# Altium schematic sheet COBConnector.SchDoc
size C; SheetNumber: 2; SheetTotal: 2
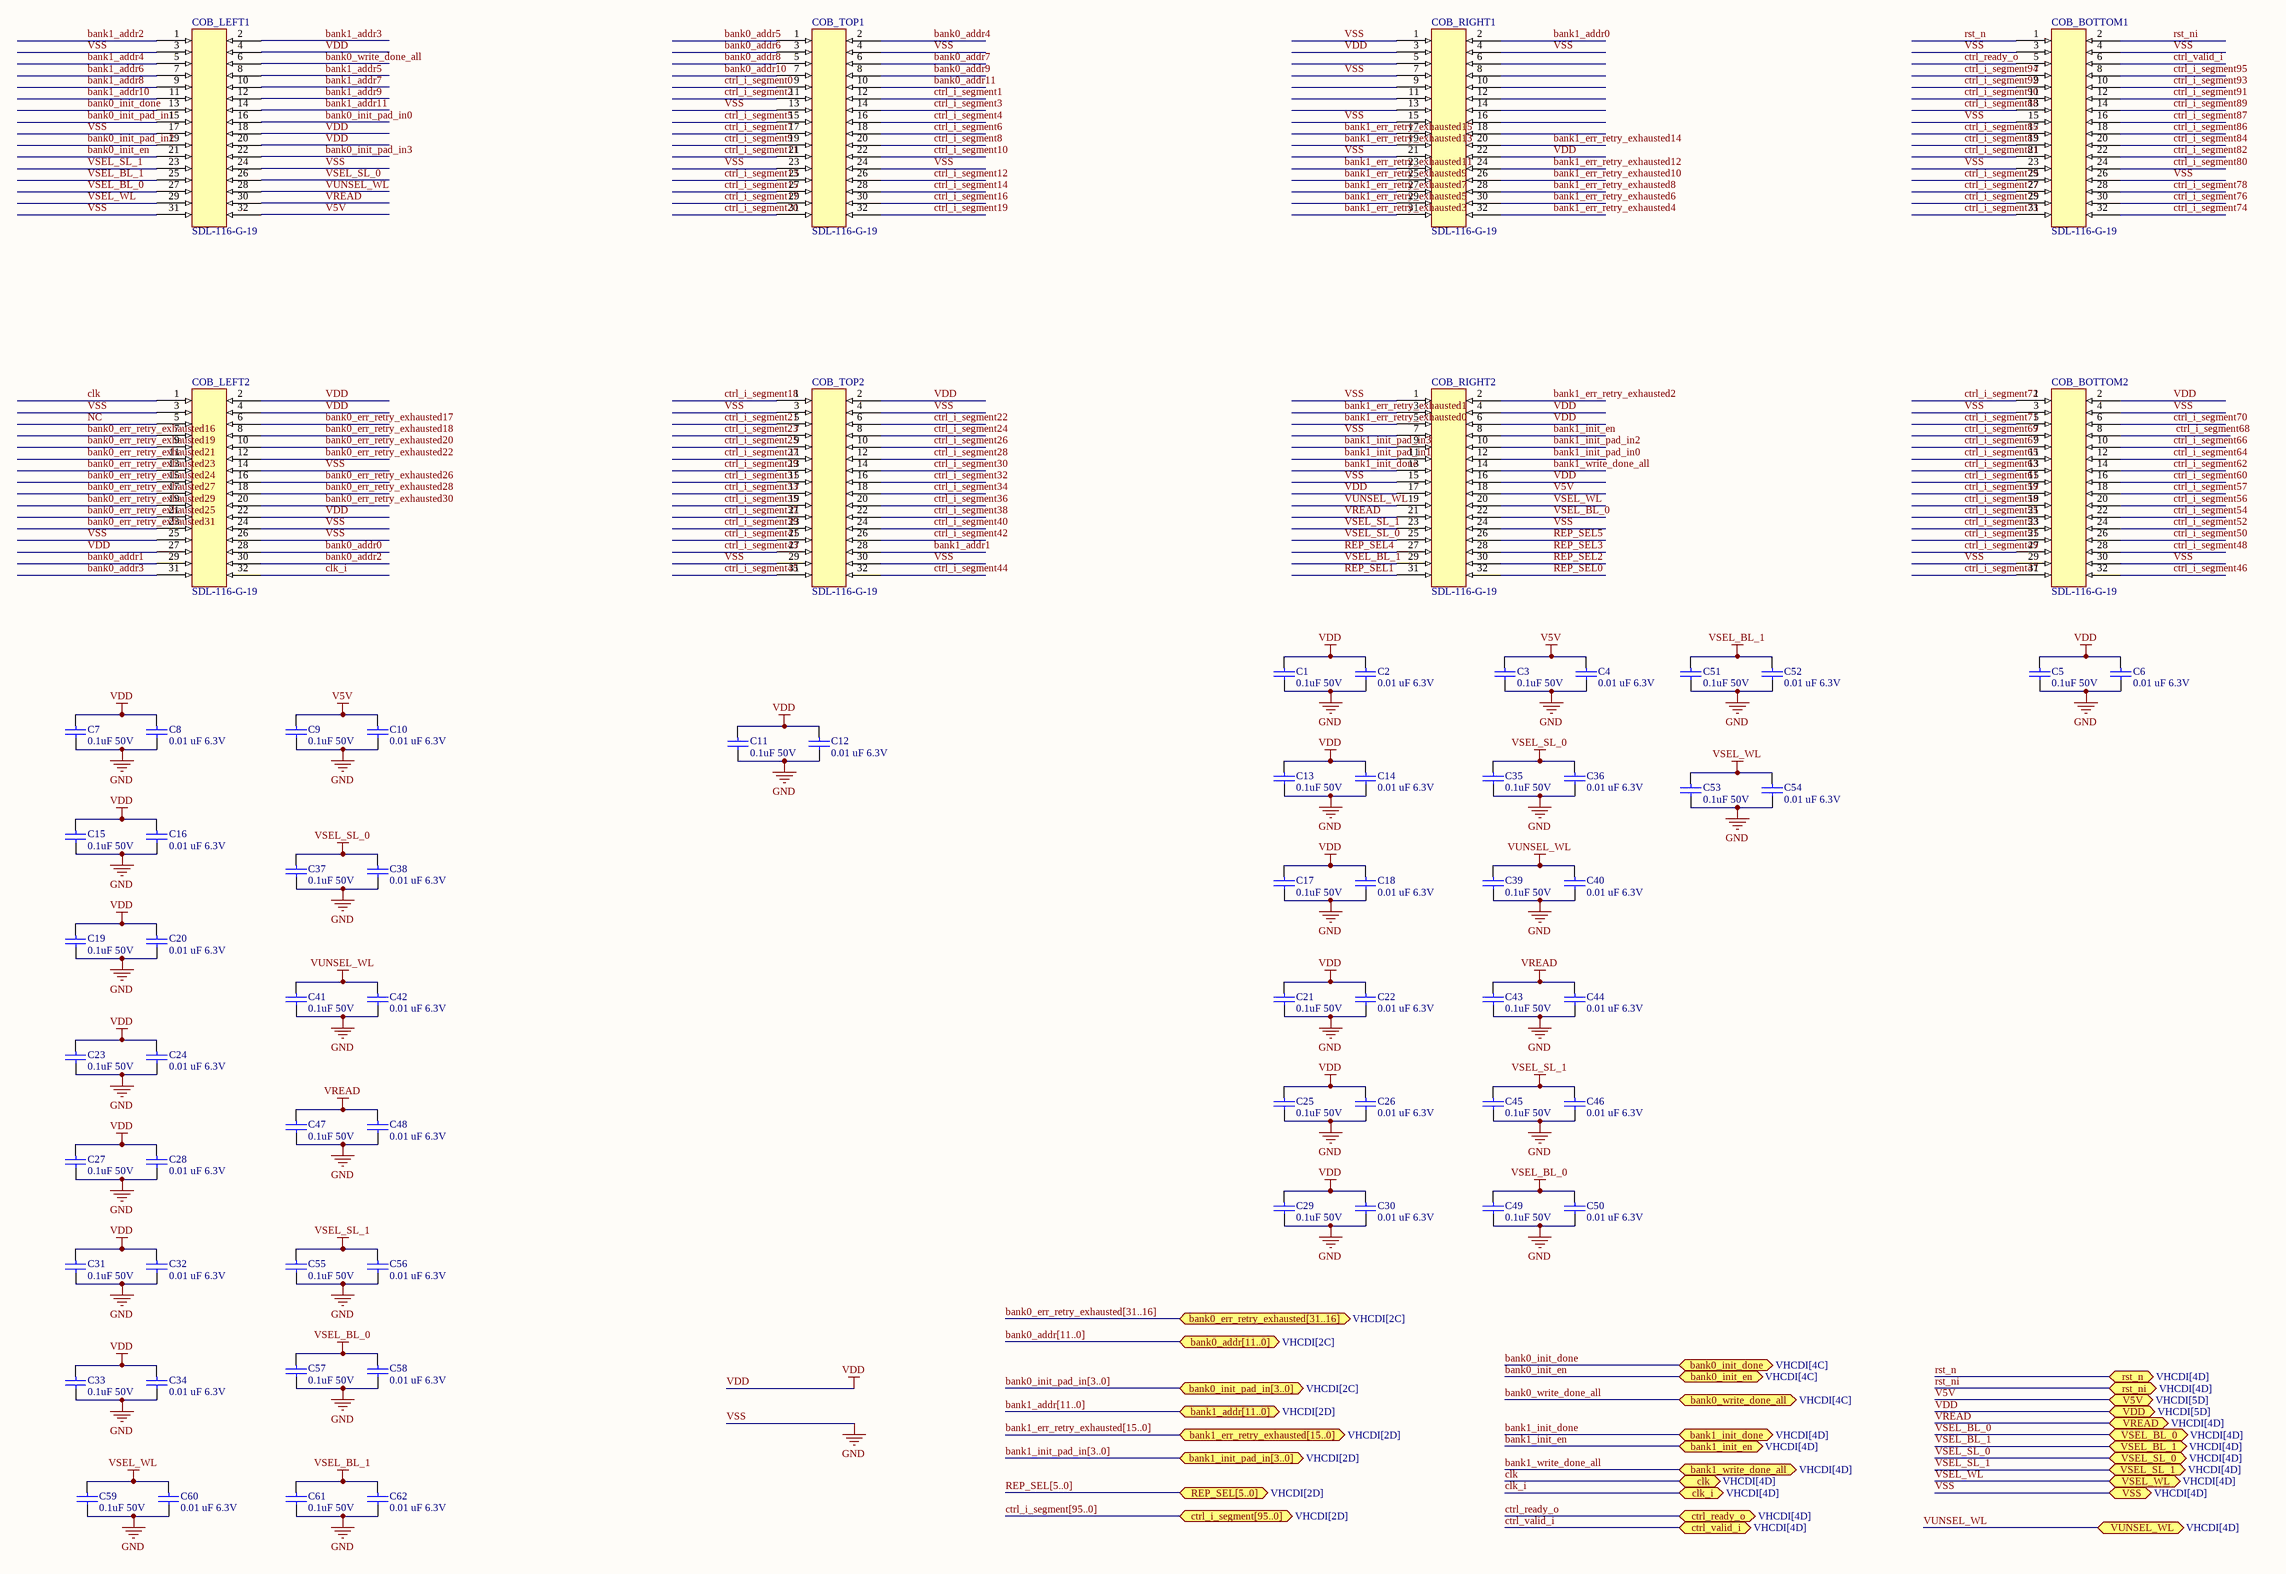
[diagram p0: COBConnector.SchDoc]

## Parts
C1  0.1uF 50V  [C0603-XXXXXX-XXX]
C2  0.01 uF 6.3V  [C0603-XXXXXX-XXX]
C3  0.1uF 50V  [C0603-XXXXXX-XXX]
C4  0.01 uF 6.3V  [C0603-XXXXXX-XXX]
C5  0.1uF 50V  [C0603-XXXXXX-XXX]
C6  0.01 uF 6.3V  [C0603-XXXXXX-XXX]
C7  0.1uF 50V  [C0603-XXXXXX-XXX]
C8  0.01 uF 6.3V  [C0603-XXXXXX-XXX]
C9  0.1uF 50V  [C0603-XXXXXX-XXX]
C10  0.01 uF 6.3V  [C0603-XXXXXX-XXX]
C11  0.1uF 50V  [C0603-XXXXXX-XXX]
C12  0.01 uF 6.3V  [C0603-XXXXXX-XXX]
C13  0.1uF 50V  [C0603-XXXXXX-XXX]
C14  0.01 uF 6.3V  [C0603-XXXXXX-XXX]
C15  0.1uF 50V  [C0603-XXXXXX-XXX]
C16  0.01 uF 6.3V  [C0603-XXXXXX-XXX]
C17  0.1uF 50V  [C0603-XXXXXX-XXX]
C18  0.01 uF 6.3V  [C0603-XXXXXX-XXX]
C19  0.1uF 50V  [C0603-XXXXXX-XXX]
C20  0.01 uF 6.3V  [C0603-XXXXXX-XXX]
C21  0.1uF 50V  [C0603-XXXXXX-XXX]
C22  0.01 uF 6.3V  [C0603-XXXXXX-XXX]
C23  0.1uF 50V  [C0603-XXXXXX-XXX]
C24  0.01 uF 6.3V  [C0603-XXXXXX-XXX]
C25  0.1uF 50V  [C0603-XXXXXX-XXX]
C26  0.01 uF 6.3V  [C0603-XXXXXX-XXX]
C27  0.1uF 50V  [C0603-XXXXXX-XXX]
C28  0.01 uF 6.3V  [C0603-XXXXXX-XXX]
C29  0.1uF 50V  [C0603-XXXXXX-XXX]
C30  0.01 uF 6.3V  [C0603-XXXXXX-XXX]
C31  0.1uF 50V  [C0603-XXXXXX-XXX]
C32  0.01 uF 6.3V  [C0603-XXXXXX-XXX]
C33  0.1uF 50V  [C0603-XXXXXX-XXX]
C34  0.01 uF 6.3V  [C0603-XXXXXX-XXX]
C35  0.1uF 50V  [C0603-XXXXXX-XXX]
C36  0.01 uF 6.3V  [C0603-XXXXXX-XXX]
C37  0.1uF 50V  [C0603-XXXXXX-XXX]
C38  0.01 uF 6.3V  [C0603-XXXXXX-XXX]
C39  0.1uF 50V  [C0603-XXXXXX-XXX]
C40  0.01 uF 6.3V  [C0603-XXXXXX-XXX]
C41  0.1uF 50V  [C0603-XXXXXX-XXX]
C42  0.01 uF 6.3V  [C0603-XXXXXX-XXX]
C43  0.1uF 50V  [C0603-XXXXXX-XXX]
C44  0.01 uF 6.3V  [C0603-XXXXXX-XXX]
C45  0.1uF 50V  [C0603-XXXXXX-XXX]
C46  0.01 uF 6.3V  [C0603-XXXXXX-XXX]
C47  0.1uF 50V  [C0603-XXXXXX-XXX]
C48  0.01 uF 6.3V  [C0603-XXXXXX-XXX]
C49  0.1uF 50V  [C0603-XXXXXX-XXX]
C50  0.01 uF 6.3V  [C0603-XXXXXX-XXX]
C51  0.1uF 50V  [C0603-XXXXXX-XXX]
C52  0.01 uF 6.3V  [C0603-XXXXXX-XXX]
C53  0.1uF 50V  [C0603-XXXXXX-XXX]
C54  0.01 uF 6.3V  [C0603-XXXXXX-XXX]
C55  0.1uF 50V  [C0603-XXXXXX-XXX]
C56  0.01 uF 6.3V  [C0603-XXXXXX-XXX]
C57  0.1uF 50V  [C0603-XXXXXX-XXX]
C58  0.01 uF 6.3V  [C0603-XXXXXX-XXX]
C59  0.1uF 50V  [C0603-XXXXXX-XXX]
C60  0.01 uF 6.3V  [C0603-XXXXXX-XXX]
C61  0.1uF 50V  [C0603-XXXXXX-XXX]
C62  0.01 uF 6.3V  [C0603-XXXXXX-XXX]
COB_BOTTOM1  SDL-116-G-19  [CON32_2X16_TU_DSL_SAI]
COB_BOTTOM2  SDL-116-G-19  [CON32_2X16_TU_DSL_SAI]
COB_LEFT1  SDL-116-G-19  [CON32_2X16_TU_DSL_SAI]
COB_LEFT2  SDL-116-G-19  [CON32_2X16_TU_DSL_SAI]
COB_RIGHT1  SDL-116-G-19  [CON32_2X16_TU_DSL_SAI]
COB_RIGHT2  SDL-116-G-19  [CON32_2X16_TU_DSL_SAI]
COB_TOP1  SDL-116-G-19  [CON32_2X16_TU_DSL_SAI]
COB_TOP2  SDL-116-G-19  [CON32_2X16_TU_DSL_SAI]

## Ports
bank0_addr[11..0] (bidir, see VHCDI[2C]), bank0_err_retry_exhausted[31..16] (bidir, see VHCDI[2C]), bank0_init_done (bidir, see VHCDI[4C]), bank0_init_en (bidir, see VHCDI[4C]), bank0_init_pad_in[3..0] (bidir, see VHCDI[2C]), bank0_write_done_all (bidir, see VHCDI[4C]), bank1_addr[11..0] (bidir, see VHCDI[2D]), bank1_err_retry_exhausted[15..0] (bidir, see VHCDI[2D]), bank1_init_done (bidir, see VHCDI[4D]), bank1_init_en (bidir, see VHCDI[4D]), bank1_init_pad_in[3..0] (bidir, see VHCDI[2D]), bank1_write_done_all (bidir, see VHCDI[4D]), clk (bidir, see VHCDI[4D]), clk_i (bidir, see VHCDI[4D]), ctrl_i_segment[95..0] (bidir, see VHCDI[2D]), ctrl_ready_o (bidir, see VHCDI[4D]), ctrl_valid_i (bidir, see VHCDI[4D]), REP_SEL[5..0] (bidir, see VHCDI[2D]), rst_n (bidir, see VHCDI[4D]), rst_ni (bidir, see VHCDI[4D]), V5V (bidir, see VHCDI[5D]), VDD (bidir, see VHCDI[5D]), VREAD (bidir, see VHCDI[4D]), VSEL_BL_0 (bidir, see VHCDI[4D]), VSEL_BL_1 (bidir, see VHCDI[4D]), VSEL_SL_0 (bidir, see VHCDI[4D]), VSEL_SL_1 (bidir, see VHCDI[4D]), VSEL_WL (bidir, see VHCDI[4D]), VSS (bidir, see VHCDI[4D]), VUNSEL_WL (bidir, see VHCDI[4D])

## Nets
V5V: C3.1 C4.1 C9.1 C10.1 COB_LEFT1.32 COB_RIGHT2.18 ; port V5V
VDD: C1.1 C2.1 C5.1 C6.1 C7.1 C8.1 C11.1 C12.1 C13.1 C14.1 C15.1 C16.1 C17.1 C18.1 C19.1 C20.1 C21.1 C22.1 C23.1 C24.1 C25.1 C26.1 C27.1 C28.1 C29.1 C30.1 C31.1 C32.1 C33.1 C34.1 COB_BOTTOM2.2 COB_LEFT1.4 COB_LEFT1.18 COB_LEFT1.20 COB_LEFT2.2 COB_LEFT2.4 COB_LEFT2.22 COB_LEFT2.27 COB_RIGHT1.3 COB_RIGHT1.22 COB_RIGHT2.4 COB_RIGHT2.6 COB_RIGHT2.16 COB_RIGHT2.17 COB_TOP2.2 ; port VDD
VREAD: C43.1 C44.1 C47.1 C48.1 COB_LEFT1.30 COB_RIGHT2.21 ; port VREAD
VSEL_BL_0: C49.1 C50.1 C57.1 C58.1 COB_LEFT1.27 COB_RIGHT2.22 ; port VSEL_BL_0
VSEL_BL_1: C51.1 C52.1 C61.1 C62.1 COB_LEFT1.25 COB_RIGHT2.29 ; port VSEL_BL_1
VSEL_SL_0: C35.1 C36.1 C37.1 C38.1 COB_LEFT1.26 COB_RIGHT2.25 ; port VSEL_SL_0
VSEL_SL_1: C45.1 C46.1 C55.1 C56.1 COB_LEFT1.23 COB_RIGHT2.23 ; port VSEL_SL_1
VSEL_WL: C53.1 C54.1 C59.1 C60.1 COB_LEFT1.29 COB_RIGHT2.20 ; port VSEL_WL
VSS: C1.2 C2.2 C3.2 C4.2 C5.2 C6.2 C7.2 C8.2 C9.2 C10.2 C11.2 C12.2 C13.2 C14.2 C15.2 C16.2 C17.2 C18.2 C19.2 C20.2 C21.2 C22.2 C23.2 C24.2 C25.2 C26.2 C27.2 C28.2 C29.2 C30.2 C31.2 C32.2 C33.2 C34.2 C35.2 C36.2 C37.2 C38.2 C39.2 C40.2 C41.2 C42.2 C43.2 C44.2 C45.2 C46.2 C47.2 C48.2 C49.2 C50.2 C51.2 C52.2 C53.2 C54.2 C55.2 C56.2 C57.2 C58.2 C59.2 C60.2 C61.2 C62.2 COB_BOTTOM1.3 COB_BOTTOM1.4 COB_BOTTOM1.15 COB_BOTTOM1.23 COB_BOTTOM1.26 COB_BOTTOM2.3 COB_BOTTOM2.4 COB_BOTTOM2.29 COB_BOTTOM2.30 COB_LEFT1.3 COB_LEFT1.17 COB_LEFT1.24 COB_LEFT1.31 COB_LEFT2.3 COB_LEFT2.14 COB_LEFT2.24 COB_LEFT2.25 COB_LEFT2.26 COB_RIGHT1.1 COB_RIGHT1.4 COB_RIGHT1.7 COB_RIGHT1.15 COB_RIGHT1.21 COB_RIGHT2.1 COB_RIGHT2.7 COB_RIGHT2.15 COB_RIGHT2.24 COB_TOP1.4 COB_TOP1.13 COB_TOP1.23 COB_TOP1.24 COB_TOP2.3 COB_TOP2.4 COB_TOP2.29 COB_TOP2.30 ; port VSS  [also labelled GND]
VUNSEL_WL: C39.1 C40.1 C41.1 C42.1 COB_LEFT1.28 COB_RIGHT2.19 ; port VUNSEL_WL
bank0_addr0: COB_LEFT2.28
bank0_addr1: COB_LEFT2.29
bank0_addr2: COB_LEFT2.30
bank0_addr3: COB_LEFT2.31
bank0_addr4: COB_TOP1.2
bank0_addr5: COB_TOP1.1
bank0_addr6: COB_TOP1.3
bank0_addr7: COB_TOP1.6
bank0_addr8: COB_TOP1.5
bank0_addr9: COB_TOP1.8
bank0_addr10: COB_TOP1.7
bank0_addr11: COB_TOP1.10
bank0_err_retry_exhausted16: COB_LEFT2.7
bank0_err_retry_exhausted17: COB_LEFT2.6
bank0_err_retry_exhausted18: COB_LEFT2.8
bank0_err_retry_exhausted19: COB_LEFT2.9
bank0_err_retry_exhausted20: COB_LEFT2.10
bank0_err_retry_exhausted21: COB_LEFT2.11
bank0_err_retry_exhausted22: COB_LEFT2.12
bank0_err_retry_exhausted23: COB_LEFT2.13
bank0_err_retry_exhausted24: COB_LEFT2.15
bank0_err_retry_exhausted25: COB_LEFT2.21
bank0_err_retry_exhausted26: COB_LEFT2.16
bank0_err_retry_exhausted27: COB_LEFT2.17
bank0_err_retry_exhausted28: COB_LEFT2.18
bank0_err_retry_exhausted29: COB_LEFT2.19
bank0_err_retry_exhausted30: COB_LEFT2.20
bank0_err_retry_exhausted31: COB_LEFT2.23
bank0_init_done: COB_LEFT1.13 ; port bank0_init_done
bank0_init_en: COB_LEFT1.21 ; port bank0_init_en
bank0_init_pad_in0: COB_LEFT1.16
bank0_init_pad_in1: COB_LEFT1.15
bank0_init_pad_in2: COB_LEFT1.19
bank0_init_pad_in3: COB_LEFT1.22
bank0_write_done_all: COB_LEFT1.6 ; port bank0_write_done_all
bank1_addr0: COB_RIGHT1.2
bank1_addr1: COB_TOP2.28
bank1_addr2: COB_LEFT1.1
bank1_addr3: COB_LEFT1.2
bank1_addr4: COB_LEFT1.5
bank1_addr5: COB_LEFT1.8
bank1_addr6: COB_LEFT1.7
bank1_addr7: COB_LEFT1.10
bank1_addr8: COB_LEFT1.9
bank1_addr9: COB_LEFT1.12
bank1_addr10: COB_LEFT1.11
bank1_addr11: COB_LEFT1.14
bank1_err_retry_exhausted0: COB_RIGHT2.5
bank1_err_retry_exhausted1: COB_RIGHT2.3
bank1_err_retry_exhausted2: COB_RIGHT2.2
bank1_err_retry_exhausted3: COB_RIGHT1.31
bank1_err_retry_exhausted4: COB_RIGHT1.32
bank1_err_retry_exhausted5: COB_RIGHT1.29
bank1_err_retry_exhausted6: COB_RIGHT1.30
bank1_err_retry_exhausted7: COB_RIGHT1.27
bank1_err_retry_exhausted8: COB_RIGHT1.28
bank1_err_retry_exhausted9: COB_RIGHT1.25
bank1_err_retry_exhausted10: COB_RIGHT1.26
bank1_err_retry_exhausted11: COB_RIGHT1.23
bank1_err_retry_exhausted12: COB_RIGHT1.24
bank1_err_retry_exhausted13: COB_RIGHT1.19
bank1_err_retry_exhausted14: COB_RIGHT1.20
bank1_err_retry_exhausted15: COB_RIGHT1.17
bank1_init_done: COB_RIGHT2.13 ; port bank1_init_done
bank1_init_en: COB_RIGHT2.8 ; port bank1_init_en
bank1_init_pad_in0: COB_RIGHT2.12
bank1_init_pad_in1: COB_RIGHT2.11
bank1_init_pad_in2: COB_RIGHT2.10
bank1_init_pad_in3: COB_RIGHT2.9
bank1_write_done_all: COB_RIGHT2.14 ; port bank1_write_done_all
clk: COB_LEFT2.1 ; port clk
clk_i: COB_LEFT2.32 ; port clk_i
ctrl_i_segment0: COB_TOP1.9
ctrl_i_segment1: COB_TOP1.12
ctrl_i_segment2: COB_TOP1.11
ctrl_i_segment3: COB_TOP1.14
ctrl_i_segment4: COB_TOP1.16
ctrl_i_segment5: COB_TOP1.15
ctrl_i_segment6: COB_TOP1.18
ctrl_i_segment7: COB_TOP1.17
ctrl_i_segment8: COB_TOP1.20
ctrl_i_segment9: COB_TOP1.19
ctrl_i_segment10: COB_TOP1.22
ctrl_i_segment11: COB_TOP1.21
ctrl_i_segment12: COB_TOP1.26
ctrl_i_segment13: COB_TOP1.25
ctrl_i_segment14: COB_TOP1.28
ctrl_i_segment15: COB_TOP1.27
ctrl_i_segment16: COB_TOP1.30
ctrl_i_segment17: COB_TOP1.29
ctrl_i_segment18: COB_TOP2.1
ctrl_i_segment19: COB_TOP1.32
ctrl_i_segment20: COB_TOP1.31
ctrl_i_segment21: COB_TOP2.5
ctrl_i_segment22: COB_TOP2.6
ctrl_i_segment23: COB_TOP2.7
ctrl_i_segment24: COB_TOP2.8
ctrl_i_segment25: COB_TOP2.9
ctrl_i_segment26: COB_TOP2.10
ctrl_i_segment27: COB_TOP2.11
ctrl_i_segment28: COB_TOP2.12
ctrl_i_segment29: COB_TOP2.13
ctrl_i_segment30: COB_TOP2.14
ctrl_i_segment31: COB_TOP2.15
ctrl_i_segment32: COB_TOP2.16
ctrl_i_segment33: COB_TOP2.17
ctrl_i_segment34: COB_TOP2.18
ctrl_i_segment35: COB_TOP2.19
ctrl_i_segment36: COB_TOP2.20
ctrl_i_segment37: COB_TOP2.21
ctrl_i_segment38: COB_TOP2.22
ctrl_i_segment39: COB_TOP2.23
ctrl_i_segment40: COB_TOP2.24
ctrl_i_segment41: COB_TOP2.25
ctrl_i_segment42: COB_TOP2.26
ctrl_i_segment43: COB_TOP2.27
ctrl_i_segment44: COB_TOP2.32
ctrl_i_segment45: COB_TOP2.31
ctrl_i_segment46: COB_BOTTOM2.32
ctrl_i_segment47: COB_BOTTOM2.31
ctrl_i_segment48: COB_BOTTOM2.28
ctrl_i_segment49: COB_BOTTOM2.27
ctrl_i_segment50: COB_BOTTOM2.26
ctrl_i_segment51: COB_BOTTOM2.25
ctrl_i_segment52: COB_BOTTOM2.24
ctrl_i_segment53: COB_BOTTOM2.23
ctrl_i_segment54: COB_BOTTOM2.22
ctrl_i_segment55: COB_BOTTOM2.21
ctrl_i_segment56: COB_BOTTOM2.20
ctrl_i_segment57: COB_BOTTOM2.18
ctrl_i_segment58: COB_BOTTOM2.19
ctrl_i_segment59: COB_BOTTOM2.17
ctrl_i_segment60: COB_BOTTOM2.16
ctrl_i_segment61: COB_BOTTOM2.15
ctrl_i_segment62: COB_BOTTOM2.14
ctrl_i_segment63: COB_BOTTOM2.13
ctrl_i_segment64: COB_BOTTOM2.12
ctrl_i_segment65: COB_BOTTOM2.11
ctrl_i_segment66: COB_BOTTOM2.10
ctrl_i_segment67: COB_BOTTOM2.9
ctrl_i_segment68: COB_BOTTOM2.8
ctrl_i_segment69: COB_BOTTOM2.7
ctrl_i_segment70: COB_BOTTOM2.6
ctrl_i_segment71: COB_BOTTOM2.5
ctrl_i_segment72: COB_BOTTOM2.1
ctrl_i_segment73: COB_BOTTOM1.31
ctrl_i_segment74: COB_BOTTOM1.32
ctrl_i_segment75: COB_BOTTOM1.29
ctrl_i_segment76: COB_BOTTOM1.30
ctrl_i_segment77: COB_BOTTOM1.27
ctrl_i_segment78: COB_BOTTOM1.28
ctrl_i_segment79: COB_BOTTOM1.25
ctrl_i_segment80: COB_BOTTOM1.24
ctrl_i_segment81: COB_BOTTOM1.21
ctrl_i_segment82: COB_BOTTOM1.22
ctrl_i_segment83: COB_BOTTOM1.19
ctrl_i_segment84: COB_BOTTOM1.20
ctrl_i_segment85: COB_BOTTOM1.17
ctrl_i_segment86: COB_BOTTOM1.18
ctrl_i_segment87: COB_BOTTOM1.16
ctrl_i_segment88: COB_BOTTOM1.13
ctrl_i_segment89: COB_BOTTOM1.14
ctrl_i_segment90: COB_BOTTOM1.11
ctrl_i_segment91: COB_BOTTOM1.12
ctrl_i_segment92: COB_BOTTOM1.9
ctrl_i_segment93: COB_BOTTOM1.10
ctrl_i_segment94: COB_BOTTOM1.7
ctrl_i_segment95: COB_BOTTOM1.8
ctrl_ready_o: COB_BOTTOM1.5 ; port ctrl_ready_o
ctrl_valid_i: COB_BOTTOM1.6 ; port ctrl_valid_i
NC: COB_LEFT2.5
REP_SEL0: COB_RIGHT2.32
REP_SEL1: COB_RIGHT2.31
REP_SEL2: COB_RIGHT2.30
REP_SEL3: COB_RIGHT2.28
REP_SEL4: COB_RIGHT2.27
REP_SEL5: COB_RIGHT2.26
rst_n: COB_BOTTOM1.1 ; port rst_n
rst_ni: COB_BOTTOM1.2 ; port rst_ni

Not connected (* = marked no-connect by the designer): COB_RIGHT1 5 6 8 9 10 11 12 13 14 16 18

## Buses and harness runs
bus bank0_addr[11..0] = port bank0_addr[11..0]
bus bank0_err_retry_exhausted[31..16] = port bank0_err_retry_exhausted[31..16]
bus bank0_init_pad_in[3..0] = port bank0_init_pad_in[3..0]
bus bank1_addr[11..0] = port bank1_addr[11..0]
bus bank1_err_retry_exhausted[15..0] = port bank1_err_retry_exhausted[15..0]
bus bank1_init_pad_in[3..0] = port bank1_init_pad_in[3..0]
bus ctrl_i_segment[95..0] = port ctrl_i_segment[95..0]
bus REP_SEL[5..0] = port REP_SEL[5..0]

## Library data of the parts
C1 C3 C5 C7 C9 C11 C13 C15 C17 C19 C21 C23 C25 C27 C29 C31 C33 C35 C37 C39 C41 C43 C45 C47 C49 C51 C53 C55 C57 C59 C61 = C0603C104M5RAC7867: 0.1 µF ±20% 50V Ceramic Capacitor X7R 0603; KMI: 821327; Value: 0.1uF 50V
C2 C4 C6 C8 C10 C12 C14 C16 C18 C20 C22 C24 C26 C28 C30 C32 C34 C36 C38 C40 C42 C44 C46 C48 C50 C52 C54 C56 C58 C60 C62 = C0603F103M9RACTU: Multilayer Ceramic Capacitors MLCC - SMD/SMT 6.3V 0.01uF X7R 0603 20%; Value: 0.01 uF 6.3V